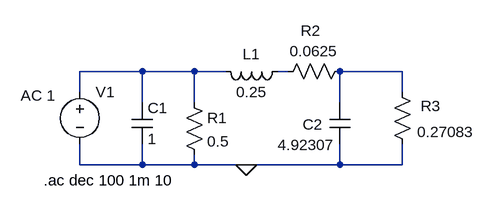
[diagram p0: schematic TS10.asc]
TS10.asc, the LTspice schematic file:
Version 4
SHEET 1 880 680
WIRE 64 80 -32 80
WIRE 144 80 64 80
WIRE 192 80 144 80
WIRE 288 80 272 80
WIRE 464 80 368 80
WIRE -32 112 -32 80
WIRE 464 112 464 80
WIRE 64 128 64 80
WIRE 144 128 144 80
WIRE 368 128 368 80
WIRE -32 224 -32 192
WIRE 64 224 64 192
WIRE 64 224 -32 224
WIRE 144 224 144 208
WIRE 144 224 64 224
WIRE 224 224 144 224
WIRE 368 224 368 192
WIRE 368 224 224 224
WIRE 464 224 464 192
WIRE 464 224 368 224
FLAG 224 224 0
SYMBOL cap 48 128 R0
SYMATTR InstName C1
SYMATTR Value 1
SYMBOL cap 352 128 R0
WINDOW 0 -41 34 Left 2
WINDOW 3 -80 65 Left 2
SYMATTR InstName C2
SYMATTR Value 4.92307
SYMBOL res 128 112 R0
SYMATTR InstName R1
SYMATTR Value 0.5
SYMBOL ind 288 64 R90
WINDOW 0 5 56 VBottom 2
WINDOW 3 32 56 VTop 2
SYMATTR InstName L1
SYMATTR Value 0.25
SYMBOL res 384 64 R90
WINDOW 0 -31 61 VBottom 2
WINDOW 3 -31 56 VTop 2
SYMATTR InstName R2
SYMATTR Value 0.0625
SYMBOL res 480 208 R180
WINDOW 0 -43 75 Left 2
WINDOW 3 -95 35 Left 2
SYMATTR InstName R3
SYMATTR Value 0.27083
SYMBOL voltage -32 96 R0
WINDOW 123 -91 21 Left 2
WINDOW 39 0 0 Left 0
SYMATTR Value2 AC 1
SYMATTR InstName V1
SYMATTR Value ""
TEXT -88 248 Left 2 !.ac dec 100 1m 10

The netlist it stands for:
* TS10.asc
C1 N001 0 1
C2 N003 0 4.92307
R1 N001 0 0.5
L1 N002 N001 0.25
R2 N003 N002 0.0625
R3 0 N003 0.27083
V1 N001 0 AC 1
.ac dec 100 1m 10
.backanno
.end